# EAGLE design Arlinked-Can (EAGLE 6.5.0)
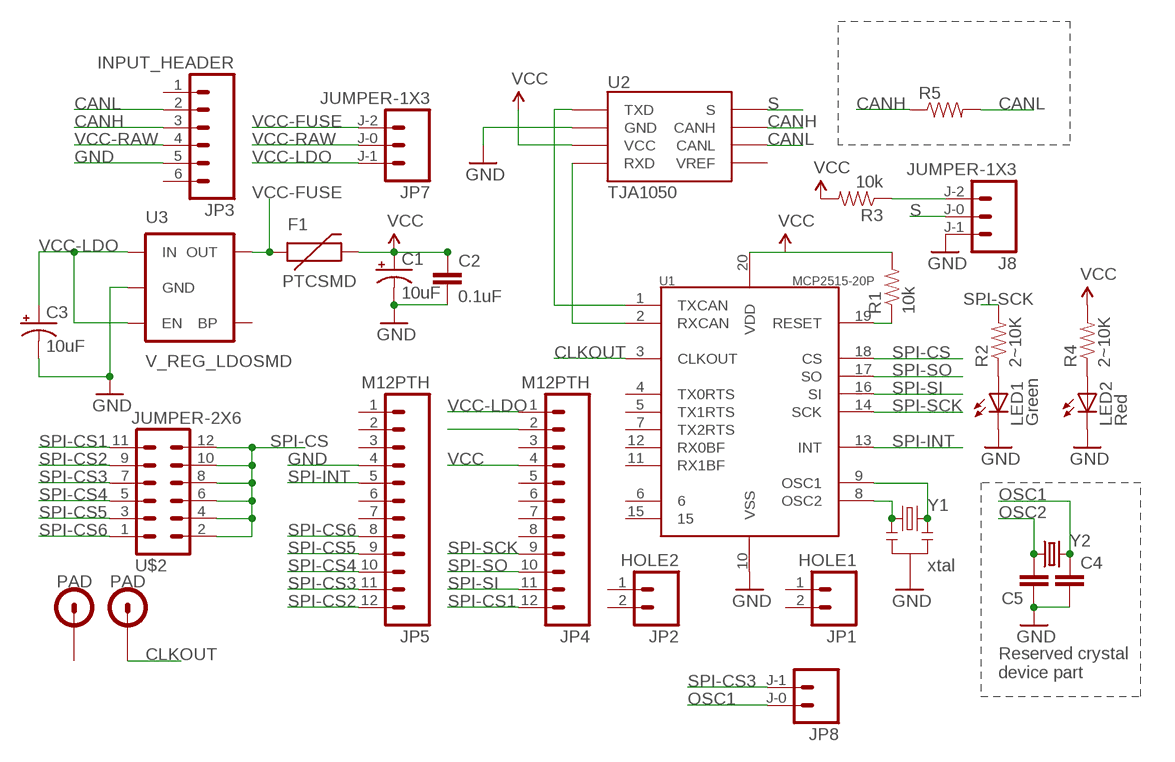
[diagram p0: schematic, sheet 1]

## Parts
C1  10uF  CAP_POL1206  [EIA3216]
C2  0.1uF  CAP0402-CAP  [0402-CAP]
C3  10uF  CAP_POL1206  [EIA3216]
C4  CAP0402-CAP  [0402-CAP]
C5  CAP0402-CAP  [0402-CAP]
F1  PTCSMD  [PTC-1206]
J8  JUMPER-1X3  [JUMPER-1X3-SMD-10]
JP1  HOLE1  M02PTH  [1X02]
JP2  HOLE2  M02PTH  [1X02]
JP3  INPUT_HEADER  M06SIP  [1X06]
JP4  M12PTH  [1X12]
JP5  M12PTH  [1X12]
JP7  JUMPER-1X3  [JUMPER-1X3-SMD-10]
JP8  JUMPER-1X2  [JUMPER-1X2-SMD-10]
LED1  Green  LED0603  [LED-0603]
LED2  Red  LED0603  [LED-0603]
R1  10k  RESISTOR0603-RES  [0603-RES]
R2  2~10K  RESISTOR0402-RES  [0402-RES]
R3  10k  RESISTOR0603-RES  [0603-RES]
R4  2~10K  RESISTOR0402-RES  [0402-RES]
R5  RESISTOR0603-RES  [0603-RES]
U1  MCP2515-20P  [TSSOP20]
U2  TJA1050  [SOIC-8]
U3  V_REG_LDOSMD  [SOT23-5]
U$1  PAD  [PAD-HOLE-4MM]
U$2  JUMPER-2X6  [JUMPER-2X06-SMD]
U$3  PAD_SMD  [PAD-SMD-2MM]
Y1  xtal  RESONATORSMD  [RESONATOR-SMD]
Y2  CRYSTALPAD-ONLY  [HC49U-V]

## Nets
CANH: JP3.3 R5.1 U2.7(CANH)
CANL: JP3.2 R5.2 U2.6(CANL)
CLKOUT: U1.3(CLKOUT) U$3.P$1
GND [vcc]: C1.C(-) C2.2 C3.C(-) C4.2 C5.1 J8.J-1 JP3.5 JP4.2 JP5.4 LED1.C LED2.C U1.10(VSS) U2.2(GND) U3.2(GND) Y1.2
LED1-CAN-2: LED1.A R2.1
LED2-POWER-2: LED2.A R4.1
N$1: U1.1(TXCAN) U2.1(TXD)
N$2: U1.2(RXCAN) U2.4(RXD)
N$5: R1.1 U1.19(RESET)
N$10: J8.J-2 R3.1
OSC1: C4.1 JP8.J-0(J-1) U1.9(OSC1) Y1.3 Y2.2
OSC2: C5.2 U1.8(OSC2) Y1.1 Y2.1
S: J8.J-0 U2.8(S)
SPI-CS: U1.18(CS) U$2.2 U$2.4 U$2.6 U$2.8 U$2.10 U$2.12
SPI-CS1: JP4.12 U$2.11
SPI-CS2: JP5.12 U$2.9
SPI-CS3: JP5.11 JP8.J-1(J-0) U$2.7
SPI-CS4: JP5.10 U$2.5
SPI-CS5: JP5.9 U$2.3
SPI-CS6: JP5.8 U$2.1
SPI-INT: JP5.5 U1.13(INT)
SPI-SCK: JP4.9 R2.2 U1.14(SCK)
SPI-SI: JP4.11 U1.16(SI)
SPI-SO: JP4.10 U1.17(SO)
VCC: C1.A(+) C2.1 F1.2 JP4.4 R1.2 R3.2 R4.2 U1.20(VDD) U2.3(VCC)
VCC-FUSE: F1.1 JP7.J-2 U3.5(OUT)
VCC-LDO: C3.A(+) JP4.1 JP7.J-1 U3.1(IN) U3.3(EN)
VCC-RAW: JP3.4 JP7.J-0
Unconnected: JP1.1 JP1.2 JP2.1 JP2.2 JP3.1 JP3.6 JP4.3 JP4.5 JP4.6 JP4.7 JP4.8 JP5.1 JP5.2 JP5.3 JP5.6 JP5.7 U1.4(TX0RTS) U1.5(TX1RTS) U1.6 U1.7(TX2RTS) U1.11(RX1BF) U1.12(RX0BF) U1.15 U2.5(VREF) U3.4(BP) U$1.P$1

## Notes on the sheet
- Reserved crystal
  device part

## Library data of the parts
C1 C3 = SparkFun:CAP_POL: Capacitor Polarized These are standard SMD and PTH capacitors. Normally 10uF, 47uF, and 100uF in electrolytic and tantalum varieties. Always verify the external diameter of the through hole cap, it varies with capacity, voltage, and manufacturer. The EIA devices should be standard.
C2 C4 C5 = SparkFun:CAP: Capacitor Standard 0603 ceramic capacitor, and 0.1" leaded capacitor.
F1 = SparkFun:PTC: Resettable Fuse PTC Resettable Fuse. Spark Fun Electronics SKU : COM-08357
J8 JP7 = Arlinked:JUMPER-1X3
JP1 JP2 = SparkFun:M02: Header 2 Standard 2-pin 0.1" header. Use with straight break away headers (SKU : PRT-00116), right angle break away headers (PRT-00553), swiss pins (PRT-00743), machine pins (PRT-00117), and female headers (PRT-00115). Molex polarized connector foot print use with SKU : PRT-08233 with associated crimp pins and housings.
JP3 = SparkFun:M06: Header 6 Standard 6-pin 0.1" header. Use with straight break away headers (SKU : PRT-00116), right angle break away headers (PRT-00553), swiss pins (PRT-00743), machine pins (PRT-00117), and female headers (PRT-00115). Molex polarized connector foot print use with SKU : PRT-08094 with associated crimp pins and housings. NOTES ON THE VARIANTS LOCK and LOCK_LONGPADS... This footprint was designed to help hold the alignment of a through-hole component (i.e. 6-pin header) while soldering it into place. You may notice that each hole has been shifted either up or down by 0.005 of an inch from it's more standard position (which is a perfectly straight line). This slight alteration caused the pins (the squares in the middle) to touch the edges of the holes. Because they are alternating, it causes a "brace" to hold the component in place. 0.005 has proven to be the perfect amount of "off-center" position when using our standard breakaway headers. Although looks a little odd when you look at the bare footprint, once you have a header in there, the alteration is very hard to notice. Also, if you push a header all the way into place, it is covered up entirely on the bottom side. This idea of altering the position of holes to aid alignment will be further integrated into the Sparkfun Library for other footprints. It can help hold any component with 3 or more connection pins.
JP4 JP5 = SparkFun:M12: Header 12 Standard 12-pin 0.1" header. Use with straight break away headers (SKU : PRT-00116), right angle break away headers (PRT-00553), swiss pins (PRT-00743), machine pins (PRT-00117), and female headers (PRT-00115).
JP8 = Arlinked:JUMPER-1X2
LED1 LED2 = SparkFun:LED: LEDs Standard schematic elements and footprints for 5mm, 3mm, 1206, and 0603 sized LEDs. 5mm - Spark Fun Electronics SKU : COM-00529 (and others)
R1-R5 = SparkFun:RESISTOR: Resistor Basic schematic elements and footprints for 0603, 1206, and PTH resistors.
U1 = Arlinked:MCP2515-20P
U2 = Arlinked:TJA1050: CAN Tranceiver
U3 = SparkFun:V_REG_LDO: Voltage Regulator LDO Standard 150mA LDO voltage regulator in SOT-23 layout. Micrel part MIC5205. BP (by-pass) pin is used to lower output noise with 470pF cap.
U$1 U$3 = Arlinked:PAD
U$2 = Arlinked:JUMPER-2X6
Y1 = SparkFun:RESONATOR: Resonator Small SMD resonator. This is the itty bitty 10/20MHz resonators with built in caps. CSTCE10M0G55 and CSTCE20M0V53. Footprint has been reviewed closely but hasn't been tested yet.
Y2 = Arlinked:CRYSTAL: Crystals Various standard crystals. Proven footprints. Spark Fun Electronics SKU : COM-00534

## Net classes
0 default: width 0.203 mm, clearance 0.205 mm
1 vcc: width 0.254 mm, clearance 0.205 mm to class 0, clearance 0.205 mm

## Board
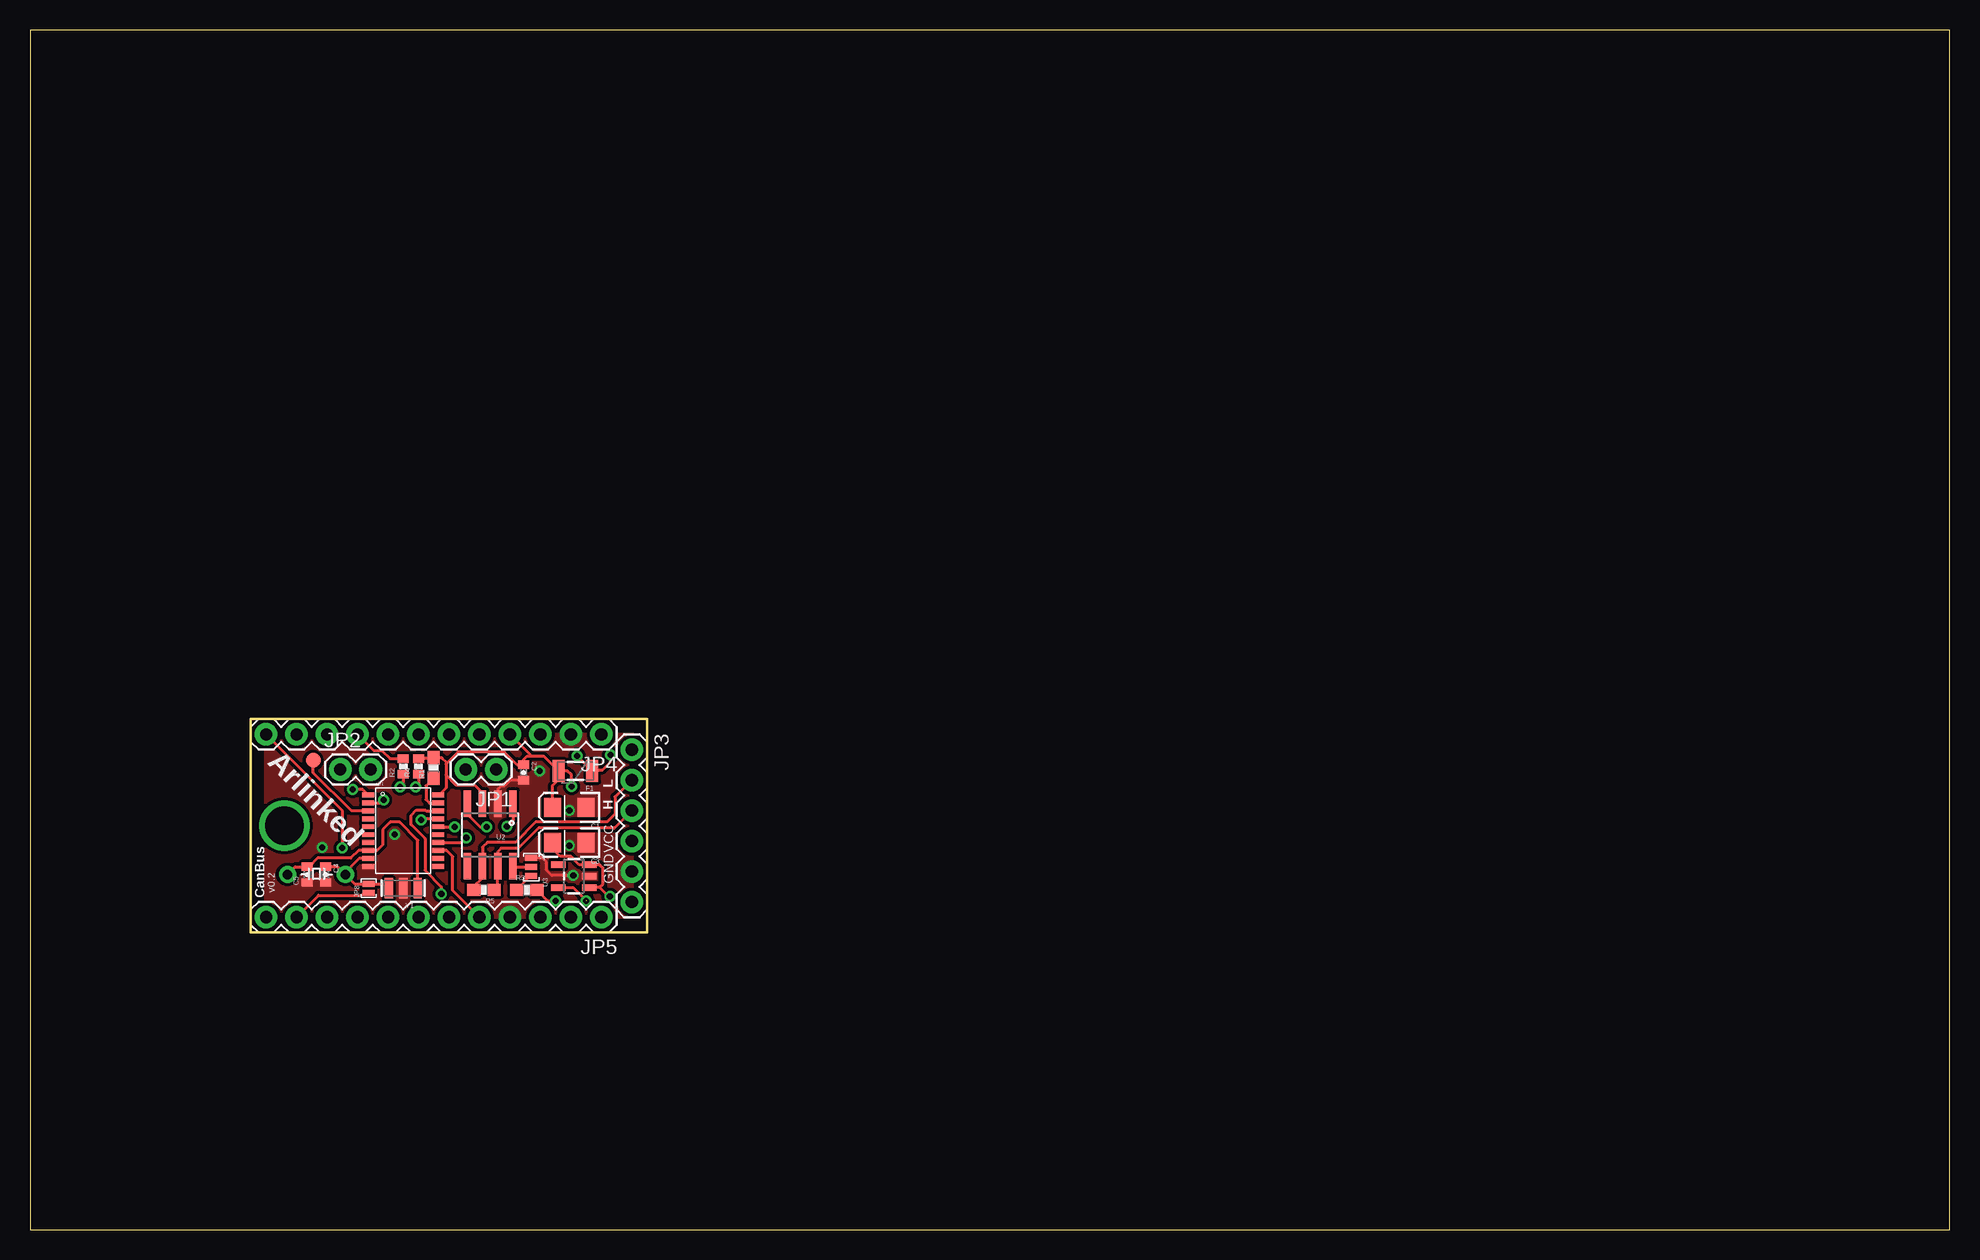
[diagram p1: board, top side]
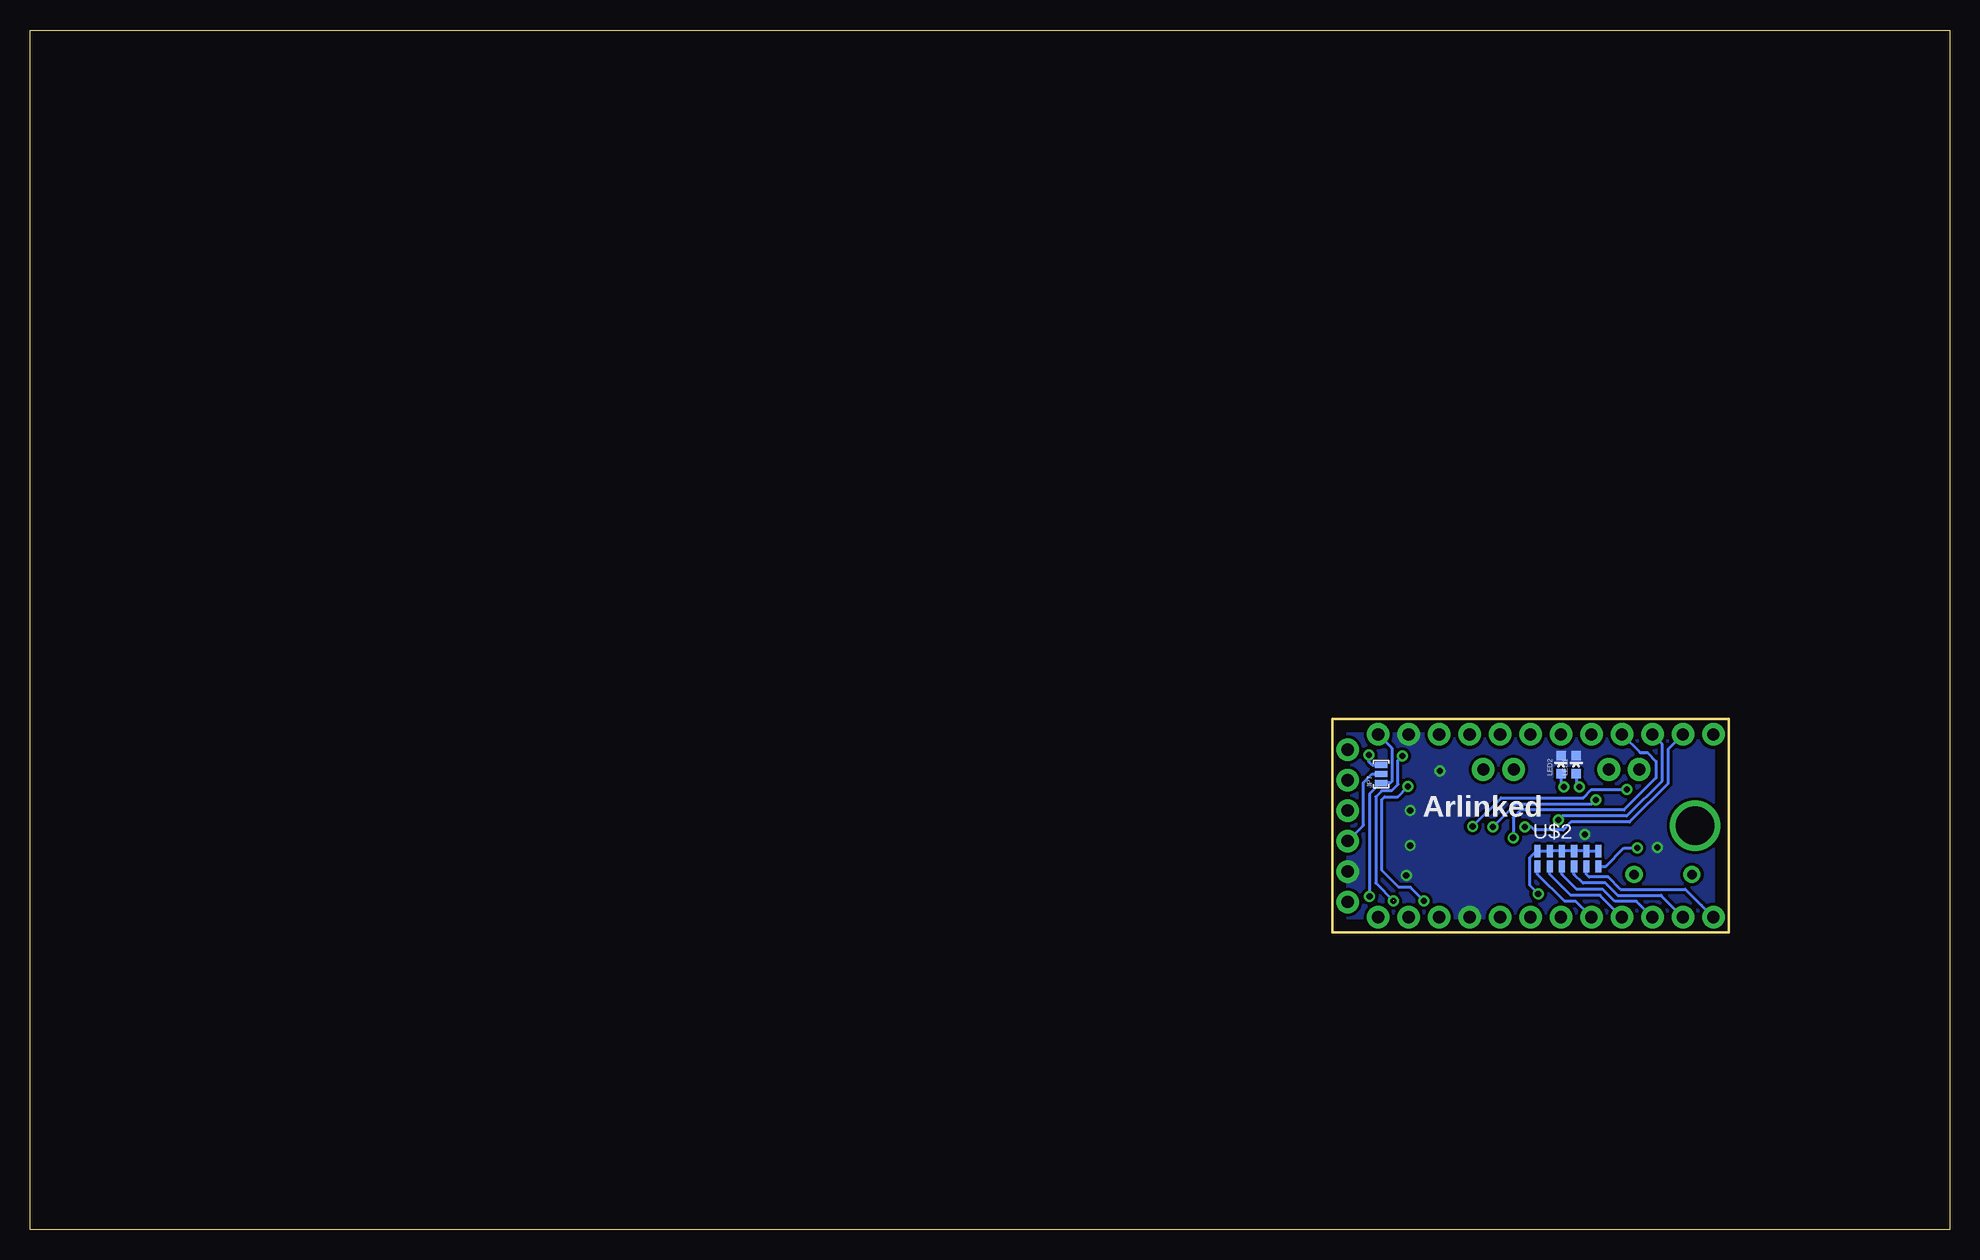
[diagram p2: board, bottom side, seen from below]

Size 160 x 100 mm. Coordinates in mm from the lower left corner, seen from the top.
Outline: 0,0 160,0 160,100 0,100 0,0
Outline: 18.41,42.55 51.44,42.55 51.44,24.77 18.41,24.77 18.41,42.55
Copper layers (1*16): Top 0.035mm / dielectric 1.5mm / Bottom 0.035mm
Design rules "default *": minimum track width 10mil, minimum drill 24mil, track to track 8mil, track to pad 8mil, pad to pad 8mil, via to via 8mil, smd to smd 8mil, copper to edge 40mil, drill to drill 8mil, minimum pad ring 12mil, minimum via ring 8mil, stop-mask expansion 4mil, vias tented up to drill 0mil, thermal gap 10mil

### Footprints (pad centres in the part's own frame; a part is rotated, then mirrored left to right if it is on the bottom)
EIA3216 = smd 1.4 x 1.6: A 1.4,0; C -1.4,0
0402-CAP = smd 0.7 x 0.9: 1 -0.65,0; 2 0.65,0
PTC-1206 = smd 1 x 1.8: 1 -1.4,0; 2 1.4,0
JUMPER-1X3-SMD-10 = smd 0.508 x 1.016: J-0 0,0; J-1 -0.762,0; J-2 0.762,0
1X02 = drill 1.016 pad 1.88: 1 0,0; 2 2.54,0
1X06 = drill 1.016 pad 1.88: 1 0,0; 2 2.54,0; 3 5.08,0; 4 7.62,0; 5 10.16,0; 6 12.7,0
1X12 = drill 1.016 pad 1.88: 1 0,0; 2 2.54,0; 3 5.08,0; 4 7.62,0; 5 10.16,0; 6 12.7,0; 7 15.24,0; 8 17.78,0; 9 20.32,0; 10 22.86,0; 11 25.4,0; 12 27.94,0
JUMPER-1X2-SMD-10 = smd 0.508 x 1.016: J-0 0.381,0; J-1 -0.381,0
LED-0603 = smd 0.8 x 0.8: A 0,-0.75; C 0,0.75
0603-RES = smd 1.1 x 1: 1 -0.85,0; 2 0.85,0
0402-RES = smd 0.7 x 0.9: 1 -0.65,0; 2 0.65,0
TSSOP20 = smd 1 x 0.4: 1 -2.937,2.693; 2 -2.937,2.032; 3 -2.937,1.372; 4 -2.937,0.712; 5 -2.937,0.051; 6 -2.937,-0.609; 7 -2.937,-1.27; 8 -2.943,-1.93; 9 -2.937,-2.59; 10 -2.937,-3.251; 11 2.905,-3.251; 12 2.905,-2.59; 13 2.911,-1.93; 14 2.905,-1.27; 15 2.905,-0.609; 16 2.905,0.051; 17 2.905,0.712; 18 2.905,1.372; 19 2.905,2.032; 20 2.905,2.693
SOIC-8 = smd 0.61 x 2.21: 1 -1.905,-2.616; 2 -0.635,-2.616; 3 0.635,-2.616; 4 1.905,-2.616; 5 1.905,2.616; 6 0.635,2.616; 7 -0.635,2.616; 8 -1.905,2.616
SOT23-5 = smd 0.55 x 1.2: 1 -0.95,-1.3; 2 0,-1.3; 3 0.95,-1.3; 4 0.95,1.3; 5 -0.95,1.3
PAD-HOLE-4MM = drill 3.2: P$1 0,0
JUMPER-2X06-SMD = smd 0.508 x 1.016: 1 -2.54,-0.635; 2 -2.54,0.634; 3 -1.524,-0.635; 4 -1.524,0.635; 5 -0.508,-0.635; 6 -0.508,0.635; 7 0.508,-0.635; 8 0.508,0.635; 9 1.524,-0.635; 10 1.524,0.635; 11 2.54,-0.635; 12 2.54,0.635
PAD-SMD-2MM = smd 1.27 x 1.27: P$1 0,0
RESONATOR-SMD = smd 0.7 x 1.7: 1 -1.2,0; 2 0,0; 3 1.2,0
HC49U-V = drill 0.813: 1 -2.413,0; 2 2.413,0

### Placement (x,y rotation side)
C1  44.96,35.18 180 top
C2  41.15,38.1 270 top
C3  44.96,32.26 180 top
C4  24.64,29.59 270 top
C5  23.11,29.59 90 top
F1  45.47,38.23 180 top
J8  41.78,30.23 270 top
JP1  38.86,38.35 180 top
JP2  25.86,38.35 0 top
JP3  50.16,40.01 270 top
JP4  47.62,41.27 180 top
JP5  47.62,26.04 180 top
JP7  47.37,37.97 90 bottom
JP8  28.22,28.45 90 top
LED1  31.11,38.73 0 bottom
LED2  32.38,38.73 0 bottom
R1  33.66,38.48 90 top
R2  31.11,38.61 90 top
R3  41.4,28.32 0 top
R4  32.38,38.61 90 top
R5  37.85,28.32 180 top
U1  31.11,33.53 0 top
U2  38.35,32.89 180 top
U3  45.34,29.46 90 top
U$1  21.21,33.66 0 top
U$2  31.8,30.91 0 bottom
U$3  23.62,39.12 0 top
Y1  31.11,28.45 180 top
Y2  23.88,29.59 0 top

### Tracks (layer width: path | path; a pad name or v marks a point on that pad's centre or on a via)
CANH
  Top 0.254: JP3.3 48.72,33.48 42.39,33.48 40.69,31.77 39.27,31.77 38.99,31.5 U2.7 38.99,28.61 R5.1
CANL
  Top 0.254: JP3.2 48.77,36.07 48.77,34.65 48.11,33.98 42.16,33.98 40.46,32.28 38.12,32.28 37.72,31.88 U2.6 37.72,29.31 37,28.59 R5.2
CLKOUT
  Top 0.254: U1.3 26.8,34.9 23.62,38.08 U$3.P$1
GND  (via drill 0.51, 0.51 pad 0.25)
  Top 0.254: v45.29,29.52 43.48,29.52 43.05,29.95 43.05,30.63 42.7,30.99 J8.J-1 | C2.2 40.02,37.45 39.55,36.98 39.27,36.98 38.99,36.7 U2.2
  other vias: 24.36,31.85 44.96,32 44.96,34.92 42.47,38.23 30.4,32.94
  pour Top (isolate 0.254, no thermals): 18.41,42.55 51.44,42.55 51.44,24.77 18.41,24.77
  pour Bottom (isolate 0.254, no thermals): 18.41,42.55 51.44,42.55 51.44,24.77 18.41,24.77
LED1-CAN-2  (via drill 0.51)
  Top 0.254: R2.1 31.11,37.13 v30.86,36.88
  Bottom 0.254: LED1.A 31.11,37.13 v30.86,36.88
LED2-POWER-2  (via drill 0.51)
  Top 0.254: R4.1 32.38,37.13 v32.13,36.88
  Bottom 0.254: LED2.A 32.38,37.13 v32.13,36.88
N$1  (via drill 0.51)
  Top 0.254: U2.1 40.26,34.11 v39.75,33.6 | U1.1 27.72,36.68 v26.9,36.68
  Bottom 0.254: v39.75,33.6 37.36,35.99 30.53,35.99 29.84,36.68 v26.9,36.68
N$2  (via drill 0.51)
  Top 0.254: U2.4 36.45,34.65 37.52,33.58 v38.05,33.58 | U1.2 29.24,35.56 v29.49,35.81
  Bottom 0.254: v38.05,33.58 36.14,35.48 29.82,35.48 v29.49,35.81
N$5
  Top 0.254: 33.41,37.63 R1.1 33.02,37 33.02,35.84 33.3,35.56 U1.19
N$10
  Top 0.254: R3.1 41.7,29.46 J8.J-2
OSC1
  Top 0.254: U1.9 27.46,30.94 26.29,29.77 Y2.2 | Y2.2 25.64,30.24 C4.1 | Y2.2 27.05,28.83 JP8.J-0 29.53,28.83 Y1.3
OSC2
  Top 0.254: Y1.1 32.31,32.45 30.81,33.96 30.02,33.96 29.41,33.35 29.41,32.08 28.93,31.6 U1.8 27.38,31.6 26.75,30.96 23.98,30.96 23.26,30.24 C5.2 22.11,30.24 Y2.1
S
  Top 0.254: U2.8 40.31,30.23 J8.J-0
SPI-CS  (via drill 0.51)
  Top 0.254: v34.29,27.99 34.29,28.57 32.92,29.95 32.92,32.59 31.75,33.76 31.75,34.52 32.21,34.98 32.94,34.98 33.02,34.9 U1.18
  Bottom 0.254: U$2.12 U$2.10 U$2.8 U$2.6 U$2.4 U$2.2 34.44,31.55 34.98,31.01 34.98,28.68 v34.29,27.99
SPI-CS1  (via drill 0.51)
  Top 0.254: JP4.12 26.04,34.92 v26.04,31.8
  Bottom 0.254: U$2.11 28.65,30.28 27.13,31.8 v26.04,31.8
SPI-CS2
  Bottom 0.254: 20.68,27.03 JP5.12 22.02,28.37 27.43,28.37 28.45,29.39 30.05,29.39 30.28,29.62 U$2.9
SPI-CS3
  Top 0.254: JP5.11 24.05,27.86 27.66,27.86 27.86,28.07 JP8.J-1
  Bottom 0.254: JP5.11 24.05,27.86 27.66,27.86 28.68,28.88 30.56,28.88 31.29,29.62 U$2.7
SPI-CS4
  Bottom 0.254: JP5.10 26.09,27.36 27.89,27.36 28.91,28.37 31.06,28.37 32.31,29.62 U$2.5
SPI-CS5
  Bottom 0.254: JP5.9 29.13,27.86 31.57,27.86 33.33,29.62 U$2.3
SPI-CS6
  Bottom 0.254: JP5.8 31.17,27.36 32.08,27.36 34.34,29.62 U$2.1
SPI-INT
  Top 0.254: JP5.5 35.23,28.27 35.23,31.09 34.72,31.6 U1.13
SPI-SCK  (via drill 0.51)
  Top 0.254: JP4.9 28.63,39.95 29.31,39.95 30.01,39.26 R2.2 | U1.14 35.97,32.26 v36.37,32.66
  Bottom 0.254: JP4.9 25.78,39.75 25.17,39.75 24.46,39.04 24.46,37.64 27.13,34.98 35.71,34.98 36.37,34.31 v36.37,32.66
SPI-SI  (via drill 0.51)
  Top 0.254: U1.16 35.36,33.58 v35.38,33.55
  Bottom 0.254: 23.11,40.39 JP4.11 23.44,40.06 23.44,37.19 26.67,33.96 31.55,33.96 32.21,33.3 34.59,33.3 34.85,33.55 v35.38,33.55
SPI-SO  (via drill 0.51)
  Top 0.254: U1.17 32.69,34.24 v32.59,34.14
  Bottom 0.254: JP4.10 23.95,40.46 23.95,37.41 26.9,34.47 32.26,34.47 v32.59,34.14
VCC  (via drill 0.51)
  Top 0.254: v45.14,36.93 45.14,37.92 44.83,38.23 F1.2 | 34.67,38.81 34.67,38.99 34.33,39.33 R1.2 | 34.67,37.9 34.67,36.8 34.02,36.15 U1.20 | F1.2 42.82,39.47 41.81,39.47 | 34.67,37.9 35.53,37.03 37.08,37.03 37.72,36.4 U2.3 | C1.A 43.56,37.01 43.92,37.36 43.92,38.08 F1.2 | 41.81,39.47 41.45,39.47 41.15,39.17 C2.1 40.6,38.75 39.53,39.83 35.69,39.83 34.67,38.81 | 34.67,38.81 34.67,37.9 | JP4.4 41.81,39.47 | R1.2 | R4.2 32.2,39.33 R1.2 | R3.2 43.17,27.41 v43.81,27.41
  Bottom 0.254: v45.14,36.93 46,36.07 47.09,36.07 47.32,35.84 47.32,29.95 45.9,28.52 44.93,28.52 v43.81,27.41
VCC-FUSE  (via drill 0.51)  (1 unrouted)
  Top 0.254: U3.5 45.27,28.51 46.35,27.43 | v45.59,39.47 46.69,38.38 46.87,38.38 F1.1 46.92,38.28 47.68,38.28 48.39,38.99 v48.39,39.57
  Bottom 0.254: JP7.J-2 48.13,38.73 48.39,38.99 v48.39,39.57 | v45.59,39.47 45.97,39.09 45.97,37.11 46.51,36.58 47.32,36.58 47.83,36.07 47.83,28.88 v46.35,27.41
VCC-LDO  (via drill 0.51 pad 0.25)
  Top 0.254: 47.49,28.51 47.75,28.78 47.75,30.15 47.49,30.41 U3.3 45.79,30.41 45.09,31.11 44.2,31.11 43.56,31.75 C3.A | 47.49,28.51 U3.1 | 47.49,28.51 48.24,27.76 v48.34,27.76
  Bottom 0.254: v48.34,27.76 48.34,36.3 47.42,37.21 JP7.J-1 46.61,37.21 46.48,37.34 46.48,40.13 JP4.1
VCC-RAW
  Bottom 0.254: JP7.J-0 48.13,37.97 48.84,37.26 48.84,33.71 JP3.4

### Text on the board
tPlace: Arlinked | L | H | VCC | v0.2 | GND | CanBus
bPlace: Arlinked